# EasyEDA Pro project backup.epro, schematic SCH_Pre_1
Create Date: 2024-03-13; Page Name: P1; Project Name: ip2366; Schematic Name: Schematic5; Update Date: 2024-03-13; Company: 嘉立创EDA; Page Size: A3; Version: V1.0
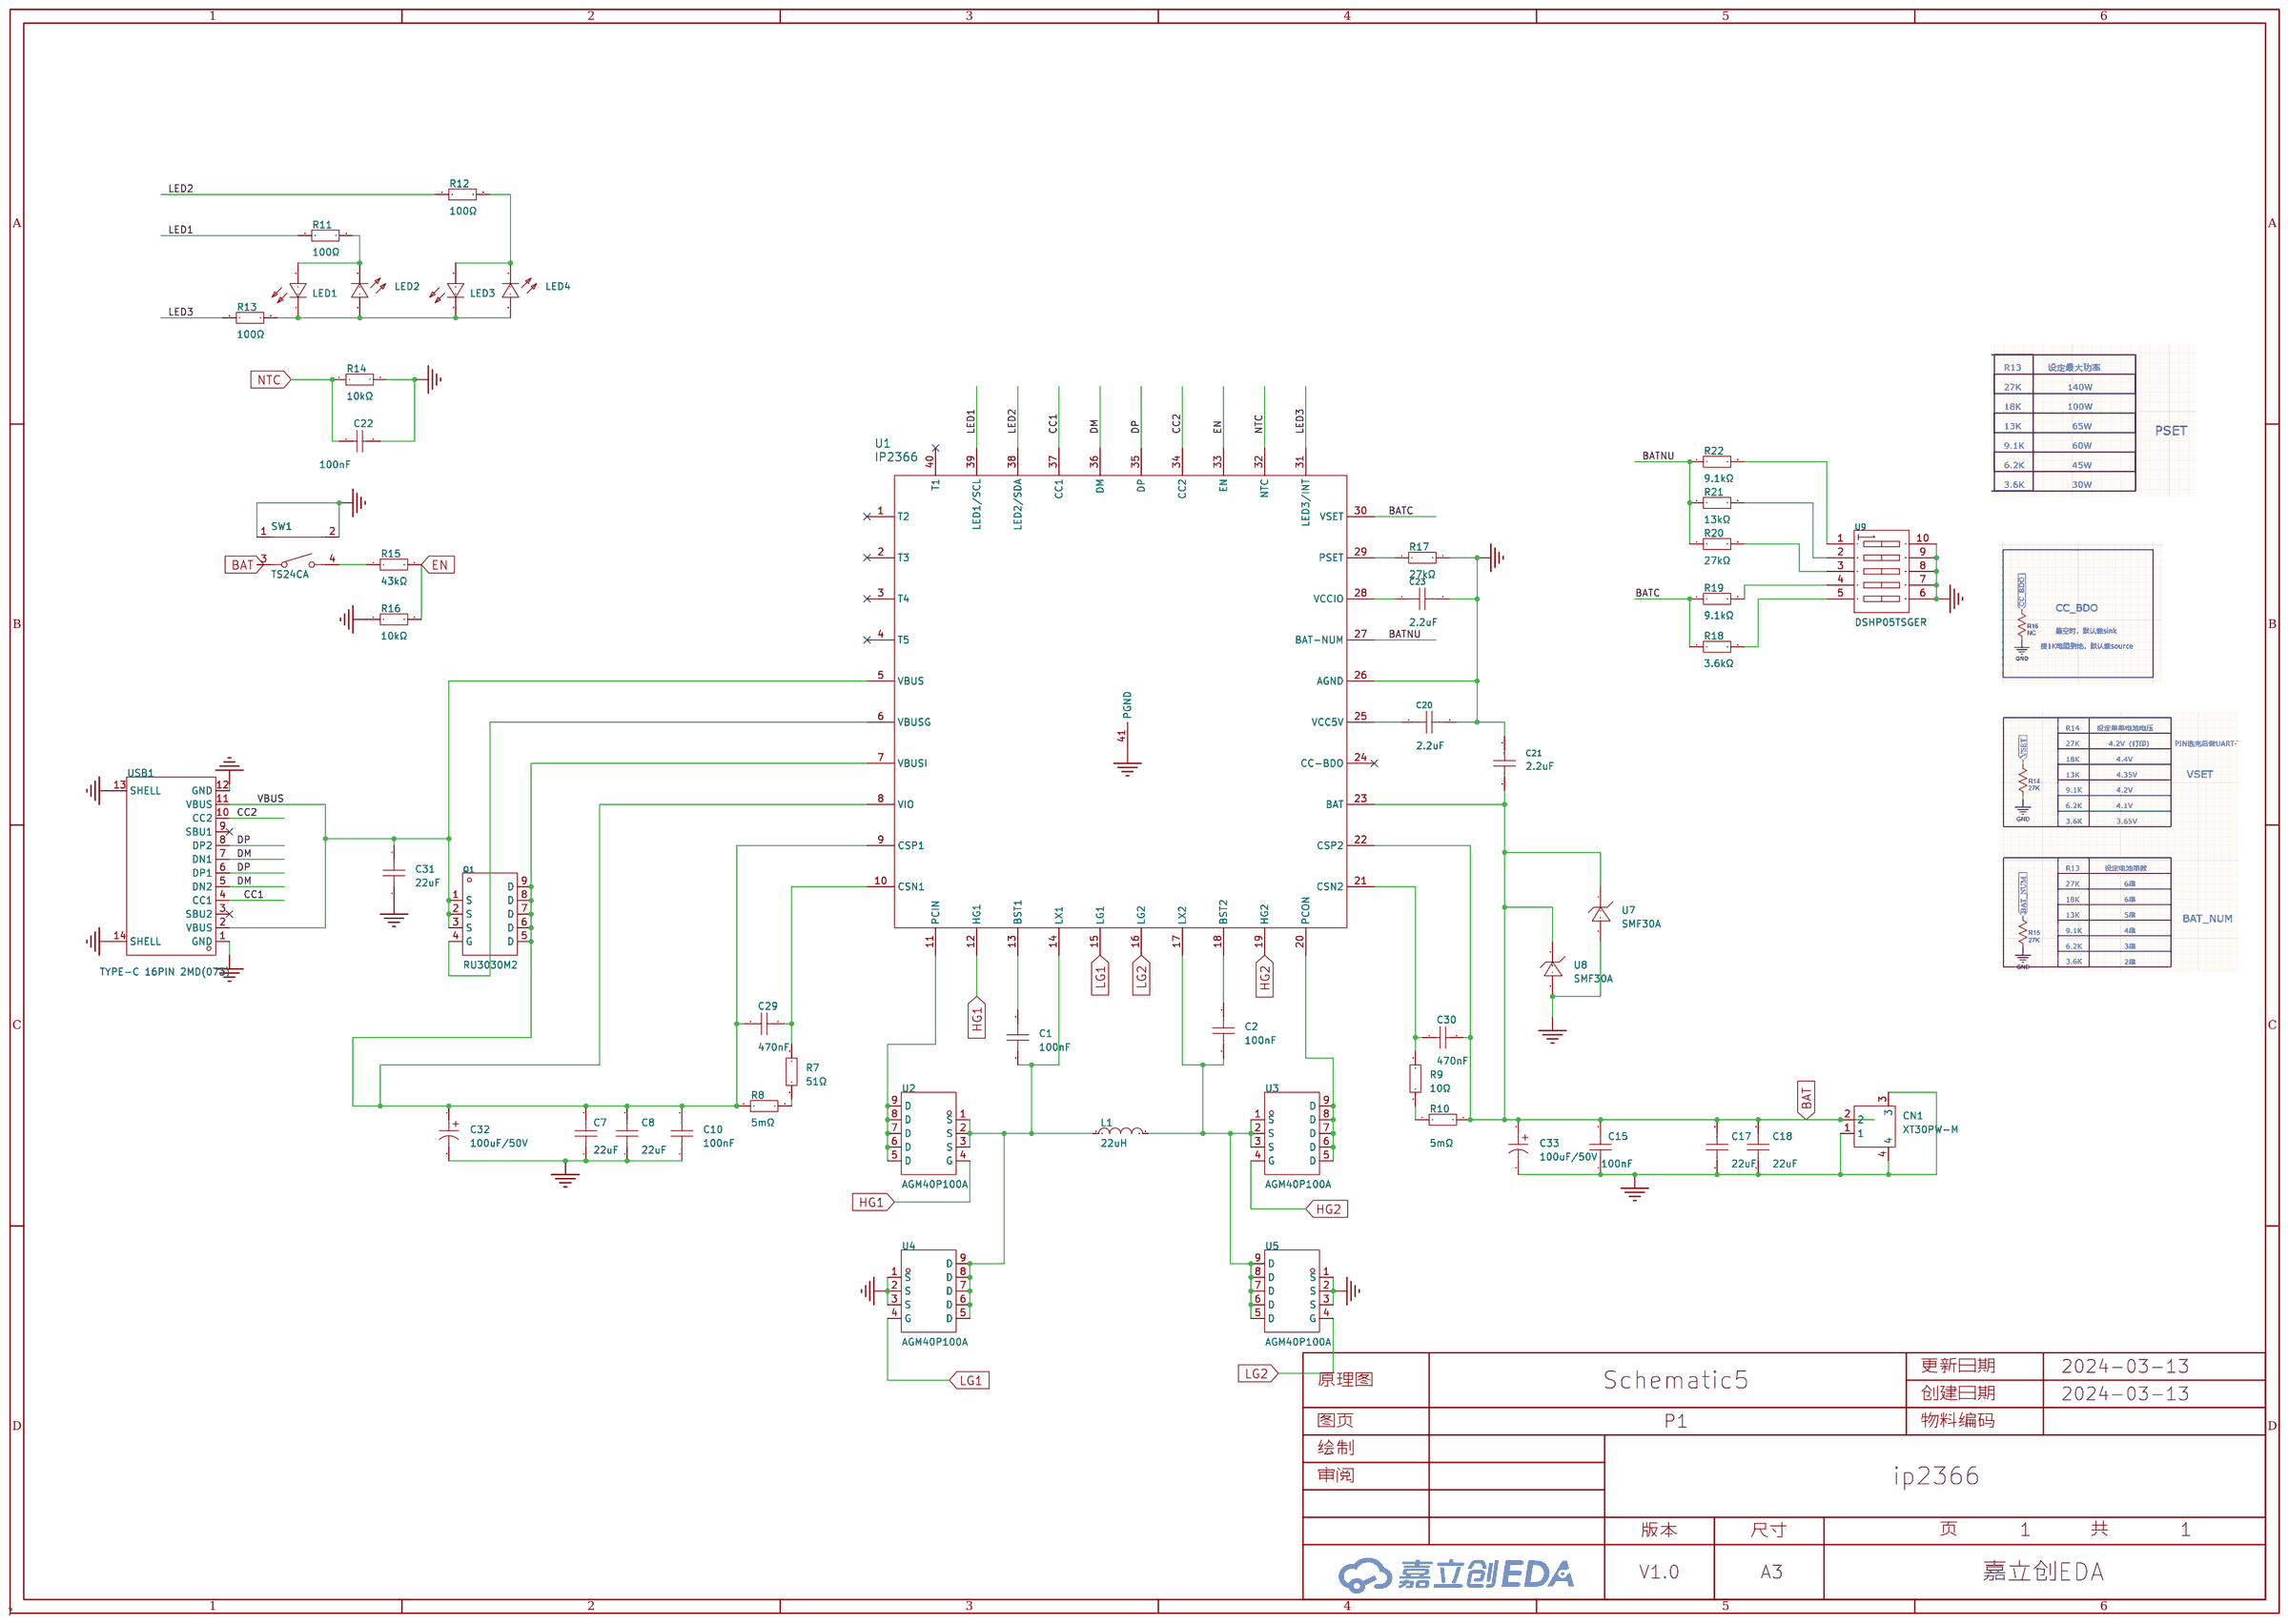
[diagram p5: schematic sheet]

## Parts
C1  100nF  [C0603]
C2  100nF  [C0603]
C7  22uF  [C1206]
C8  22uF  [C1206]
C10  100nF  [C0603]
C15  100nF  [C0603]
C17  22uF  [C1206]
C18  22uF  [C1206]
C20  2.2uF  [C0603]
C21  2.2uF  [C0603]
C22  100nF  [C0603]
C23  2.2uF  [C0603]
C29  470nF  [C0603]
C30  470nF  [C0603]
C31  22uF  [C1206]
C32  100uF/50V  [CAP-TH_BD8.0-P3.50-D0.6-FD]
C33  100uF/50V  [CAP-TH_BD8.0-P3.50-D0.6-FD]
CN1  XT30PW-M  [CONN-TH_XT30PW-M]
L1  22uH  [IND-SMD_L13.45-W12.6]
LED1  NCD0603R1  [LED0603-RD_RED]
LED2  NCD0603R1  [LED0603-RD_RED]
LED3  NCD0603R1  [LED0603-RD_RED]
LED4  NCD0603R1  [LED0603-RD_RED]
Q1  RU3030M2  [PDFN3333-8_L3.1-W3.2-P0.65-LS3.4-BL]
R7  51Ω  [R0603]
R8  5mΩ  [R1206]
R9  10Ω  [R0603]
R10  5mΩ  [R1206]
R11  100Ω  [R0603]
R12  100Ω  [R0603]
R13  100Ω  [R0603]
R14  10kΩ  [R0603]
R15  43kΩ  [R0603]
R16  10kΩ  [R0603]
R17  27kΩ  [R0603]
R18  3.6kΩ  [R0603]
R19  9.1kΩ  [R0603]
R20  27kΩ  [R0603]
R21  13kΩ  [R0603]
R22  9.1kΩ  [R0603]
SW1  TS24CA  [SW-SMD_TS24CA]
U1  IP2366  [IP2366]
U2  AGM40P100A  [DFN-8_L5.8-W4.9-P1.27-LS6.0-BL-1]
U3  AGM40P100A  [DFN-8_L5.8-W4.9-P1.27-LS6.0-BL-1]
U4  AGM40P100A  [DFN-8_L5.8-W4.9-P1.27-LS6.0-BL-1]
U5  AGM40P100A  [DFN-8_L5.8-W4.9-P1.27-LS6.0-BL-1]
U7  SMF30A  [SOD-123FL_L2.7-W1.8-LS3.7-RD]
U8  SMF30A  [SOD-123FL_L2.7-W1.8-LS3.7-RD]
U9  DSHP05TSGER  [SW-SMD_10P-P1.27-L7.8-W5.4]
USB1  TYPE-C 16PIN 2MD(073)  [USB-C-SMD_TYPE-C-6PIN-2MD-073]

## Library data of the parts
C1 C2 C10 C15 C22 = 0603B104K500NT: 容值:100nF;精度:±10%;额定电压:50V;材质(温度系数):X7R;; LCSC Part Name: 100nF ±10% 50V; Supplier Part: C30926; Manufacturer: FH(风华); Supplier Footprint: 0603; JLCPCB Part Class: Extended Part; Datasheet: https://atta.szlcsc.com/upload/public/pdf/source/20200305/C486355_26A10D38EF8C2A5C37091D0039909270.pdf; Supplier: LCSC; Tolerance: ±10%; Voltage Rated: 50V; Temperature Coefficient: X7R
C7 C8 C17 C18 C31 = C3216X5R1V226MTJ00E: 容值:22uF;精度:±20%;额定电压:35V;材质(温度系数):X5R;; LCSC Part Name: 22uF ±20% 35V; Supplier Part: C342620; Manufacturer: TDK; Supplier Footprint: 1206; JLCPCB Part Class: Extended Part; Datasheet: https://atta.szlcsc.com/upload/public/pdf/source/20190612/C361180_85CC9FB0751BEA97238DE56AB4AF0B1F.pdf; Supplier: LCSC; Tolerance: ±20%; Voltage Rated: 35V; Temperature Coefficient: X5R
C20 C21 C23 = CL10A225KB8NNNC: 容值:2.2uF;精度:±10%;额定电压:50V;材质(温度系数):X5R;; LCSC Part Name: 2.2uF ±10% 50V; Supplier Part: C913904; Manufacturer: SAMSUNG(三星); Supplier Footprint: 0603; JLCPCB Part Class: Extended Part; Datasheet: https://atta.szlcsc.com/upload/public/pdf/source/20160218/1457707763339.pdf; Supplier: LCSC; Tolerance: ±10%; Voltage Rated: 50V; Temperature Coefficient: X5R
C29 C30 = 0603B474K500NT: 容值:470nF;精度:±10%;额定电压:50V;材质(温度系数):X7R;; LCSC Part Name: 470nF ±10% 50V; Supplier Part: C77572; Manufacturer: FH(风华); Supplier Footprint: 0603; JLCPCB Part Class: Extended Part; Datasheet: https://atta.szlcsc.com/upload/public/pdf/source/20200305/C486355_26A10D38EF8C2A5C37091D0039909270.pdf; Supplier: LCSC; Tolerance: ±10%; Voltage Rated: 50V; Temperature Coefficient: X7R
C32 C33 = 100uF/50V: Supplier Part: C9900004739; Supplier Footprint: 1CAP-TH_BD8.0-P3.50-D0.6-FD; JLCPCB Part Class: 扩展库; Supplier: LCSC
CN1 = XT30PW-M: 类别:-;类型1:-;; LCSC Part Name: AMASS(艾迈斯)航模插头 卧式弯脚 XT30PW-M公头; Supplier Part: C431092; Manufacturer: AMASS(艾迈斯); JLCPCB Part Class: 扩展库; Datasheet: https://atta.szlcsc.com/upload/public/pdf/source/20220222/6A9F22F7850E25B33E1BE430ADF8560B.pdf; Supplier: LCSC; Brand: 艾迈斯; Type: 航模插头; RatedVoltage: DC 500V; InterfaceType: 公头; RatedCurrent: 15A; RecommendedWireGauge: 16/18/20AWG; contact resistance: 1.2mΩ; specifications: 2pin
L1 = FXL1360-220-M: 电感值:22uH;精度:±20%;额定电流:5A;饱和电流(Isat):7.5A;类型:一体成型电感;; LCSC Part Name: 22uH ±20% 7.5A; Supplier Part: C526028; Manufacturer: cjiang(长江微电); Supplier Footprint: SMD,12.6x13.5mm; JLCPCB Part Class: Extended Part; Datasheet: https://atta.szlcsc.com/upload/public/pdf/source/20230516/EDBB5FB099B441B256CFB4945AE848AD.pdf; Supplier: LCSC; Tolerance: ±20%; Rated Current: 5A; Saturation Current (Isat): 7.5A; DC Resistance (DCR): 39.5mΩ; Type: 一体成型电感
LED1-LED4 = NCD0603R1_C84263: 灯头类型:-;发光颜色:红色;正向电压(VF):1.6V~2.6V;功率:65mW;正向电流:20mA;主波长:615nm~630nm;二极管配置:独立二极管;透镜颜色:无色透明透镜;色温:-;发光强度:80mcd~220mcd;发光角度:130°;载带方式:-;工作温度:-30℃~+85℃;; Supplier Part: C84263; Manufacturer: 国星光电; Supplier Footprint: 0603; JLCPCB Part Class: Extended Part; Datasheet: https://atta.szlcsc.com/upload/public/pdf/source/20200820/C84263_DABC6A75E58F576973B407FDBA283D60.pdf; Supplier: LCSC; Emitted Color: 红色; Forward Voltage (VF): 1.6V~2.6V; Power Dissipation: 65mW; Forward Current: 20mA; Dominant Wavelength: 615nm~630nm; Diode Configuration: 独立二极管; Lens Color: 无色透明透镜; Luminous Intensity: 80mcd~220mcd; Viewing Angle: 130°; Operating Temperature: -30℃~+85℃
Q1 = RU3030M2: 类型:N沟道;漏源电压(Vdss):30V;连续漏极电流(Id):30A;功率(Pd):29W;导通电阻(RDS(on)@Vgs,Id):15mΩ@10V,20A;阈值电压(Vgs(th)@Id):2.5V@250uA;; LCSC Part Name: N沟道 耐压:30V 电流:30A; Supplier Part: C180957; Manufacturer: Ruichips(锐骏半导体); Supplier Footprint: PDFN3333-8; JLCPCB Part Class: 扩展库; Datasheet: https://atta.szlcsc.com/upload/public/pdf/source/20180301/C180957_15198944352791383984.pdf; Supplier: LCSC; Type: N沟道; Drain Source Voltage (Vdss): 30V; Continuous Drain Current (Id): 30A; Power Dissipation (Pd): 29W; Drain Source On Resistance (RDS(on)@Vgs,Id): 15mΩ@10V,20A; Gate Threshold Voltage (Vgs(th)@Id): 2.5V@250uA
R7 = 0603WAF510JT5E: 电阻类型:厚膜电阻;阻值:51Ω;精度:±1%;功率:100mW;最大工作电压:75V;温度系数:±100ppm/℃;; LCSC Part Name: 51Ω ±1% 100mW 厚膜电阻; Supplier Part: C23197; Manufacturer: UNI-ROYAL(厚声); Supplier Footprint: 0603; JLCPCB Part Class: Basic Part; Datasheet: https://atta.szlcsc.com/upload/public/pdf/source/20200306/C422600_1E6D84923E4A46A82E41ADD87F860B5C.pdf; Supplier: LCSC; Type: 厚膜电阻; Tolerance: ±1%; Power(Watts): 100mW; Overload Voltage (Max): 75V; Temperature Coefficient: ±100ppm/℃; Operating Temperature Range: -55℃~+155℃
R8 R10 = RLM12FTCMR005: 阻值:5mΩ;精度:±1%;功率:1W;温度系数:±100ppm/℃;; LCSC Part Name: 5mΩ ±1% 1W; Supplier Part: C316225; Manufacturer: 大毅科技; Supplier Footprint: 1206; JLCPCB Part Class: Extended Part; Datasheet: https://atta.szlcsc.com/upload/public/pdf/source/20181023/C316226_D363EC3D88B44FBEE1B74F4A1DF43EB9.pdf; Supplier: LCSC; Tolerance: ±1%; Power(Watts): 1W; Temperature Coefficient: ±100ppm/℃
R9 = 0603WAF100JT5E: 电阻类型:厚膜电阻;阻值:10Ω;精度:±1%;功率:100mW;最大工作电压:75V;温度系数:±400ppm/℃;; LCSC Part Name: 10Ω ±1% 100mW 厚膜电阻; Supplier Part: C22859; Manufacturer: UNI-ROYAL(厚声); Supplier Footprint: 0603; JLCPCB Part Class: Basic Part; Datasheet: https://atta.szlcsc.com/upload/public/pdf/source/20200306/C422600_1E6D84923E4A46A82E41ADD87F860B5C.pdf; Supplier: LCSC; Type: 厚膜电阻; Tolerance: ±1%; Power(Watts): 100mW; Overload Voltage (Max): 75V; Temperature Coefficient: ±400ppm/℃; Operating Temperature Range: -55℃~+155℃
R11-R13 = RC0603FR-07100RL: 电阻类型:厚膜电阻;阻值:100Ω;精度:±1%;功率:100mW;最大工作电压:75V;温度系数:±100ppm/℃;; LCSC Part Name: 厚膜电阻 100Ω ±1% 100mW; Supplier Part: C105588; Manufacturer: YAGEO(国巨); Supplier Footprint: 0603; JLCPCB Part Class: Extended Part; Datasheet: https://atta.szlcsc.com/upload/public/pdf/source/20180316/70C0E2BDAE7FCC62C531A5A58D202EE1.pdf; Supplier: LCSC; Type: 厚膜电阻; Tolerance: ±1%; Power(Watts): 100mW; Overload Voltage (Max): 75V; Temperature Coefficient: ±100ppm/℃; Operating Temperature Range: -55℃~+155℃
R14 R16 = 0603WAF1002T5E: 电阻类型:厚膜电阻;阻值:10kΩ;精度:±1%;功率:100mW;最大工作电压:75V;温度系数:±100ppm/℃;; LCSC Part Name: 厚膜电阻 10kΩ ±1% 100mW; Supplier Part: C25804; Manufacturer: UNI-ROYAL(厚声); Supplier Footprint: 0603; JLCPCB Part Class: Basic Part; Datasheet: https://atta.szlcsc.com/upload/public/pdf/source/20200306/C422600_1E6D84923E4A46A82E41ADD87F860B5C.pdf; Supplier: LCSC; Type: 厚膜电阻; Tolerance: ±1%; Power(Watts): 100mW; Overload Voltage (Max): 75V; Temperature Coefficient: ±100ppm/℃; Operating Temperature Range: -55℃~+155℃
R15 = 0603WAF4302T5E: 电阻类型:厚膜电阻;阻值:43kΩ;精度:±1%;功率:100mW;最大工作电压:75V;温度系数:±100ppm/℃;; LCSC Part Name: 43kΩ ±1% 100mW 厚膜电阻; Supplier Part: C23172; Manufacturer: UNI-ROYAL(厚声); Supplier Footprint: 0603; JLCPCB Part Class: Extended Part; Datasheet: https://atta.szlcsc.com/upload/public/pdf/source/20200306/C422600_1E6D84923E4A46A82E41ADD87F860B5C.pdf; Supplier: LCSC; Type: 厚膜电阻; Tolerance: ±1%; Power(Watts): 100mW; Overload Voltage (Max): 75V; Temperature Coefficient: ±100ppm/℃; Operating Temperature Range: -55℃~+155℃
R17 R20 = 0603WAF2702T5E: 电阻类型:厚膜电阻;阻值:27kΩ;精度:±1%;功率:100mW;最大工作电压:75V;温度系数:±100ppm/℃;; LCSC Part Name: 27kΩ ±1% 100mW 厚膜电阻; Supplier Part: C22967; Manufacturer: UNI-ROYAL(厚声); Supplier Footprint: 0603; JLCPCB Part Class: Basic Part; Datasheet: https://atta.szlcsc.com/upload/public/pdf/source/20200306/C422600_1E6D84923E4A46A82E41ADD87F860B5C.pdf; Supplier: LCSC; Type: 厚膜电阻; Tolerance: ±1%; Power(Watts): 100mW; Overload Voltage (Max): 75V; Temperature Coefficient: ±100ppm/℃; Operating Temperature Range: -55℃~+155℃
R18 = 0603WAF3601T5E: 电阻类型:厚膜电阻;阻值:3.6kΩ;精度:±1%;功率:100mW;最大工作电压:75V;温度系数:±100ppm/℃;; LCSC Part Name: 3.6kΩ ±1% 100mW 厚膜电阻; Supplier Part: C22980; Manufacturer: UNI-ROYAL(厚声); Supplier Footprint: 0603; JLCPCB Part Class: Basic Part; Datasheet: https://atta.szlcsc.com/upload/public/pdf/source/20200306/C422600_1E6D84923E4A46A82E41ADD87F860B5C.pdf; Supplier: LCSC; Type: 厚膜电阻; Tolerance: ±1%; Power(Watts): 100mW; Overload Voltage (Max): 75V; Temperature Coefficient: ±100ppm/℃; Operating Temperature Range: -55℃~+155℃
R19 R22 = 0603WAF9101T5E: 电阻类型:厚膜电阻;阻值:9.1kΩ;精度:±1%;功率:100mW;最大工作电压:75V;温度系数:±100ppm/℃;; LCSC Part Name: 9.1kΩ ±1% 100mW 厚膜电阻; Supplier Part: C23260; Manufacturer: UNI-ROYAL(厚声); Supplier Footprint: 0603; JLCPCB Part Class: Basic Part; Datasheet: https://atta.szlcsc.com/upload/public/pdf/source/20200306/C422600_1E6D84923E4A46A82E41ADD87F860B5C.pdf; Supplier: LCSC; Type: 厚膜电阻; Tolerance: ±1%; Power(Watts): 100mW; Overload Voltage (Max): 75V; Temperature Coefficient: ±100ppm/℃; Operating Temperature Range: -55℃~+155℃
R21 = 0603WAF1302T5E: 电阻类型:厚膜电阻;阻值:13kΩ;精度:±1%;功率:100mW;最大工作电压:75V;温度系数:±100ppm/℃;; LCSC Part Name: 13kΩ ±1% 100mW 厚膜电阻; Supplier Part: C22797; Manufacturer: UNI-ROYAL(厚声); Supplier Footprint: 0603; JLCPCB Part Class: Basic Part; Datasheet: https://atta.szlcsc.com/upload/public/pdf/source/20200306/C422600_1E6D84923E4A46A82E41ADD87F860B5C.pdf; Supplier: LCSC; Type: 厚膜电阻; Tolerance: ±1%; Power(Watts): 100mW; Overload Voltage (Max): 75V; Temperature Coefficient: ±100ppm/℃; Operating Temperature Range: -55℃~+155℃
SW1 = TS24CA: 电路结构:单刀单掷;按钮形状:矩形按钮;安装方式:卧贴;开关长度:4.55mm;开关宽度:1.8mm;开关高度:3.5mm;触点电流:50mA;额定电压(DC):12V;带灯:-;机械寿命:-;; LCSC Part Name: 4.55*1.8*3.5mm 卧贴 轻触开关; Supplier Part: C393942; Manufacturer: SHOU HAN(首韩); Supplier Footprint: SMD; JLCPCB Part Class: 扩展库; Datasheet: https://atta.szlcsc.com/upload/public/pdf/source/20190521/C393942_591A9E318887EFA4274D34029981AD99.pdf; Supplier: LCSC; Circuit: 单刀单掷; Actuator Style: 矩形按钮; Mounting Style: 卧贴; Switch Length: 4.55mm; Switch Width: 1.8mm; Switch Height: 3.5mm; Contact Current: 50mA; Voltage Rating (DC): 12V
U1 = IP2366
U2-U5 = AGM40P100A: 类型:P沟道;漏源电压(Vdss):40V;连续漏极电流(Id):95A;功率(Pd):135W;导通电阻(RDS(on)@Vgs,Id):4.6mΩ@10V,12A;阈值电压(Vgs(th)@Id):1.6V@250uA;; LCSC Part Name: P沟道 耐压:40V 电流:95A; Supplier Part: C5297499; Manufacturer: AGM-Semi(芯控源); Supplier Footprint: PDFN(5x6); JLCPCB Part Class: 扩展库; Datasheet: https://atta.szlcsc.com/upload/public/pdf/source/20221201/511D27D203436C72B4CA5CBA245F8FD2.pdf; Supplier: LCSC; Type: P沟道; Drain Source Voltage (Vdss): 40V; Continuous Drain Current (Id): 95A; Power Dissipation (Pd): 135W; Drain Source On Resistance (RDS(on)@Vgs,Id): 4.6mΩ@10V,12A; Gate Threshold Voltage (Vgs(th)@Id): 1.6V@250uA; Total Gate Charge (Qg@Vgs): 106nC@10V; Input Capacitance (Ciss@Vds): 5.7nF@20V; Operating Temperature: -55℃~+150℃@(Tj)
U7 U8 = SMF30A_C2943743: 反向截止电压(Vrwm):30V;最大钳位电压:48.4V;峰值脉冲电流(Ipp)@10/1000us:4.1A;击穿电压:33.3V;; Supplier Part: C2943743; Manufacturer: GOODWORK(固得沃克); Supplier Footprint: SOD-123FL; JLCPCB Part Class: 扩展库; Datasheet: https://atta.szlcsc.com/upload/public/pdf/source/20220524/AA0A0E50DAB96579C66583AA0A8CF024.pdf; Supplier: LCSC; Reverse Stand-Off Voltage (Vrwm): 30V; Maximum Clamping Voltage: 48.4V; Peak Pulse Current (Ipp)@10/1000us: 4.1A; Breakdown Voltage: 33.3V; Reverse Leakage Current (Ir): 1uA; Type: TVS
U9 = DSHP05TSGER_C3293145: 电路结构:单刀单掷;开关位数:5位;额定电流:25mA;额定电压:24V;使用寿命:3千次;颜色:黑色;; LCSC Part Name: 5位 1.27mm间距SMD KE拨码开关 DIPswitch; Supplier Part: C3293145; Manufacturer: 康深; Supplier Footprint: SMD-10P,5.4x7.9mm; JLCPCB Part Class: Extended Part; Datasheet: https://atta.szlcsc.com/upload/public/pdf/source/20220713/A60E769B1887052A7FF0FAA9E3A7CA10.pdf; Supplier: LCSC; Circuit: 单刀单掷; Number of Positions: 5位; Lead Pitch: 1.27mm; Current Rating: 25mA; Voltage Rating: 24V; Operating Temperature: -30℃~+85℃; Operating Life: 3千次; Color: 黑色
USB1 = TYPE-C 16PIN 2MD(073): 连接器类型:Type-C;标准:-;公母:母;端口数量:1;触点数量:16P;安装方式:卧贴;额定电流 - 电源:5A;工作温度范围:-25℃~+85℃;; LCSC Part Name: Type-C 母 卧贴; Supplier Part: C2765186; Manufacturer: SHOU HAN(首韩); Supplier Footprint: SMD; JLCPCB Part Class: 扩展库; Datasheet: https://atta.szlcsc.com/upload/public/pdf/source/20211123/39B17C16241EAC15C5E277BDA434118E.pdf; Supplier: LCSC; Connector Type: Type-C; Gender: 母; Number of Ports: 1; Number of Contacts: 16P; Mounting Style: 卧贴; Current Rating - Power (Max): 5A; Operating Temperature Range: -25℃~+85℃

## Nets
GND: C7.1 C8.1 C10.1 C15.1 C17.1 C18.1 C20.2 C21.2 C22.2 C23.2 C31.2 C32.2 C33.2 CN1.1 CN1.3 CN1.4 R14.2 R16.1 R17.2 SW1.1 SW1.2 U1.26(AGND) U1.41(PGND) U4.1(S) U4.2(S) U4.3(S) U5.1(S) U5.2(S) U5.3(S) U7.2(A) U8.2(A) U9.6(B5) U9.7(B4) U9.8(B3) U9.9(B2) U9.10(B1) USB1.1(GND) USB1.12(GND) USB1.13(SHELL) USB1.14(SHELL)
VBUS: C31.1 Q1.1(S) Q1.2(S) Q1.3(S) U1.5(VBUS) USB1.2(VBUS) USB1.11(VBUS)
BAT: C15.2 C17.2 C18.2 C21.1 C30.2 C33.1 CN1.2 R10.2 SW1.3 U1.22(CSP2) U1.23(BAT) U7.1(C) U8.1(C)
BATC: R18.1 R19.1 U1.30(VSET)
BATNU: R20.1 R21.1 R22.1 U1.27(BAT-NUM)
CC1: U1.37(CC1) USB1.4(CC1)
CC2: U1.34(CC2) USB1.10(CC2)
DM: U1.36(DM) USB1.5(DN2) USB1.7(DN1)
DP: U1.35(DP) USB1.6(DP1) USB1.8(DP2)
EN: R15.2 R16.2 U1.33(EN)
HG1: U1.12(HG1) U2.4(G)
HG2: U1.19(HG2) U3.4(G)
LED1: R11.1 U1.39(LED1/SCL)
LED2: R12.1 U1.38(LED2/SDA)
LED3: R13.1 U1.31(LED3/INT)
LG1: U1.15(LG1) U4.4(G)
LG2: U1.16(LG2) U5.4(G)
NTC: C22.1 R14.1 U1.32(NTC)
$C1_1: C1.1 L1.1 U1.14(LX1) U2.1(S) U2.2(S) U2.3(S) U4.5(D) U4.6(D) U4.7(D) U4.8(D) U4.9(D)
$C1_2: C1.2 U1.13(BST1)
$C2_1: C2.1 L1.2 U1.17(LX2) U3.1(S) U3.2(S) U3.3(S) U5.5(D) U5.6(D) U5.7(D) U5.8(D) U5.9(D)
$C2_2: C2.2 U1.18(BST2)
$C7_2: C7.2 C8.2 C10.2 C29.1 C32.1 Q1.5(D) Q1.6(D) Q1.7(D) Q1.8(D) Q1.9(D) R8.1 U1.7(VBUSI) U1.8(VIO) U1.9(CSP1)
$C20_1: C20.1 U1.25(VCC5V)
$C23_1: C23.1 U1.28(VCCIO)
$C29_2: C29.2 R7.2 U1.10(CSN1)
$C30_1: C30.1 R9.2 U1.21(CSN2)
$LED1_1: LED1.1(K) LED2.2(A) LED3.1(K) LED4.2(A) R13.2
$LED1_2: LED1.2(A) LED2.1(K) R11.2
$LED3_2: LED3.2(A) LED4.1(K) R12.2
$Q1_4: Q1.4(G) U1.6(VBUSG)
$R7_1: R7.1 R8.2
$R9_1: R9.1 R10.1
$R15_1: R15.1 SW1.4
$R17_1: R17.1 U1.29(PSET)
$R18_2: R18.2 U9.5(A5)
$R19_2: R19.2 U9.4(A4)
$R20_2: R20.2 U9.3(A3)
$R21_2: R21.2 U9.2(A2)
$R22_2: R22.2 U9.1(A1)
$U1_11: U1.11(PCIN) U2.5(D) U2.6(D) U2.7(D) U2.8(D) U2.9(D)
$U1_20: U1.20(PCON) U3.5(D) U3.6(D) U3.7(D) U3.8(D) U3.9(D)

Not connected (* = marked no-connect by the designer): U1 1(T2)* 2(T3)* 3(T4)* 4(T5)* 24(CC-BDO)* 40(T1)*; USB1 3(SBU2)* 9(SBU1)*
